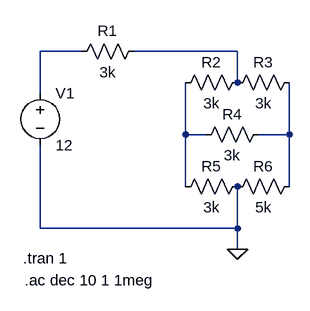
[diagram p0: schematic Task2.asc]
Task2.asc, the LTspice schematic file:
Version 4
SHEET 1 880 680
WIRE 96 64 32 64
WIRE 336 64 176 64
WIRE 336 112 336 64
WIRE 32 128 32 64
WIRE 256 192 256 112
WIRE 288 192 256 192
WIRE 416 192 416 112
WIRE 416 192 368 192
WIRE 256 272 256 192
WIRE 416 272 416 192
WIRE 32 336 32 208
WIRE 336 336 336 272
WIRE 336 336 32 336
WIRE 336 368 336 336
FLAG 336 368 0
SYMBOL voltage 32 112 R0
WINDOW 123 0 0 Left 0
WINDOW 39 0 0 Left 0
SYMATTR InstName V1
SYMATTR Value 12
SYMBOL res 192 48 R90
WINDOW 0 0 56 VBottom 2
WINDOW 3 32 56 VTop 2
SYMATTR InstName R1
SYMATTR Value 3k
SYMBOL res 240 128 R270
WINDOW 0 32 56 VTop 2
WINDOW 3 0 56 VBottom 2
SYMATTR InstName R2
SYMATTR Value 3k
SYMBOL res 320 128 R270
WINDOW 0 32 56 VTop 2
WINDOW 3 0 56 VBottom 2
SYMATTR InstName R3
SYMATTR Value 3k
SYMBOL res 272 208 R270
WINDOW 0 32 56 VTop 2
WINDOW 3 0 56 VBottom 2
SYMATTR InstName R4
SYMATTR Value 3k
SYMBOL res 240 288 R270
WINDOW 0 32 56 VTop 2
WINDOW 3 0 56 VBottom 2
SYMATTR InstName R5
SYMATTR Value 3k
SYMBOL res 320 288 R270
WINDOW 0 32 56 VTop 2
WINDOW 3 0 56 VBottom 2
SYMATTR InstName R6
SYMATTR Value 5k
TEXT 6 382 Left 2 !.tran 1
TEXT 8 416 Left 2 !.ac dec 10 1 1meg

The netlist it stands for:
* Task2.asc
V1 N001 0 12
R1 N002 N001 3k
R2 N003 N002 3k
R3 N002 N004 3k
R4 N003 N004 3k
R5 N003 0 3k
R6 0 N004 5k
.tran 1
.ac dec 10 1 1meg
.backanno
.end